# Altium schematic sheet wifi.SchDoc
size A
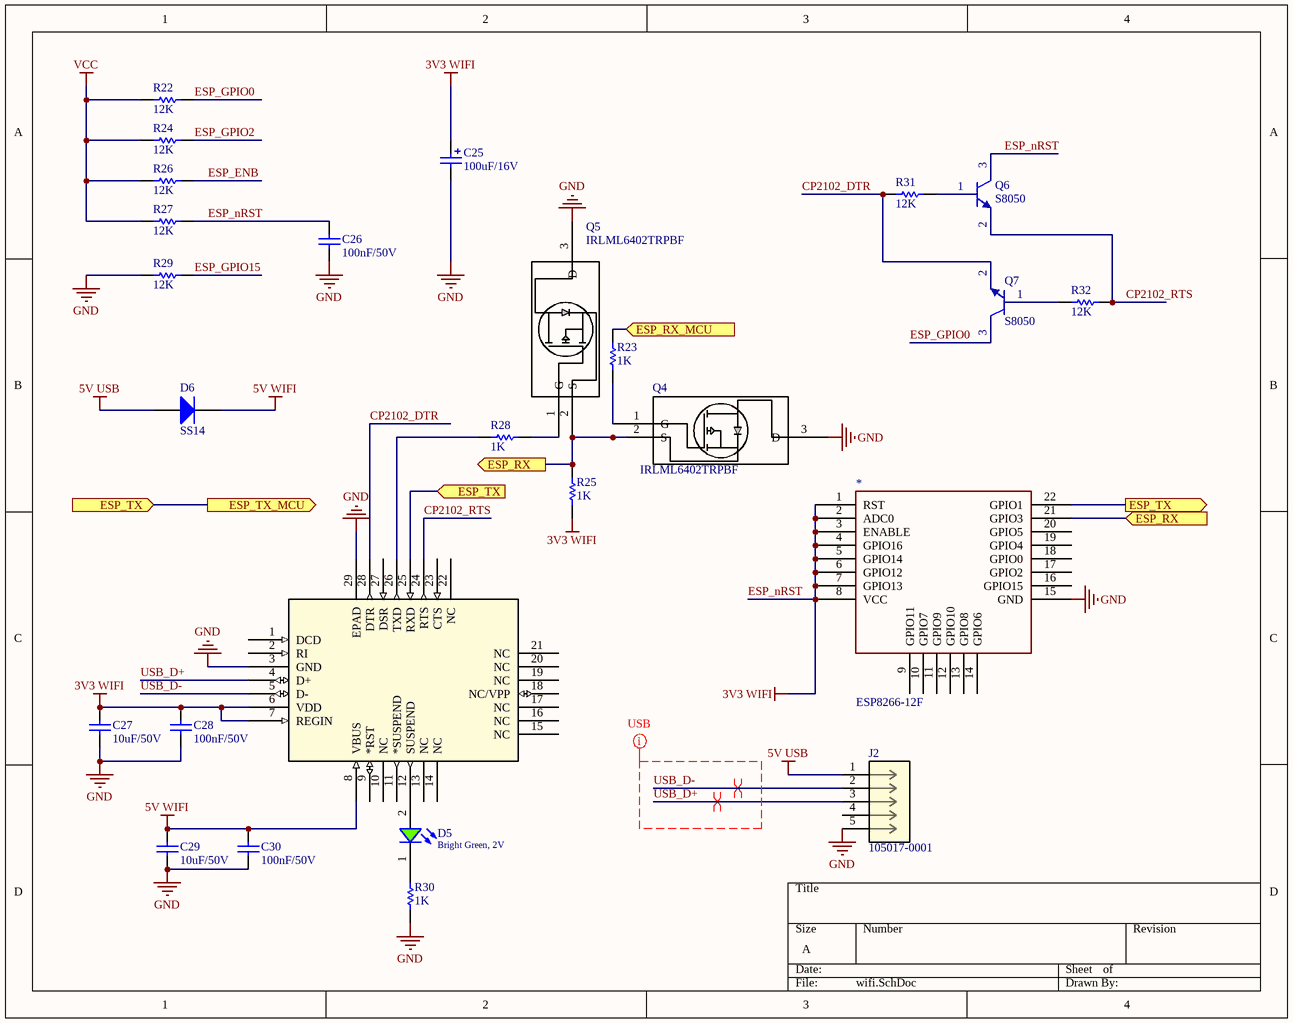
[diagram p0: wifi.SchDoc]

## Parts
*  ESP8266-12F  [ESP8266-12F]
?  (no value)  [QFN28_5X5_SIL]
C25  value 100uF/16V  [CAP_SM_TAN]  (hidden comment: TAJB107M006RNJ)
C26  value 100nF/50V  [CAP-SM-0805]  (hidden comment: Cap-100nF-50V-0805)
C27  value 10uF/50V  [CAP-SM-0805]  (hidden comment: Cap-10uF-50V-0805)
C28  value 100nF/50V  [CAP-SM-0805]  (hidden comment: Cap-100nF-50V-0805)
C29  value 10uF/50V  [CAP-SM-0805]  (hidden comment: Cap-10uF-50V-0805)
C30  value 100nF/50V  [CAP-SM-0805]  (hidden comment: Cap-100nF-50V-0805)
D5  Bright Green, 2V  [WL-SMCW_0805]
D6  SS14  [SS14]
J2  105017-0001  [CONN_105017-0001]
Q4  IRLML6402TRPBF  [SOT23_INF]
Q5  IRLML6402TRPBF  [SOT23_INF]
Q6  S8050  [SOT23_NEX]
Q7  S8050  [SOT23_NEX]
R22  value 12K  [RES-SM-0805]  (hidden comment: Res-12K-0805)
R23  value 1K  [RES-SM-0805]  (hidden comment: Res-1K-0805)
R24  value 12K  [RES-SM-0805]  (hidden comment: Res-12K-0805)
R25  value 1K  [RES-SM-0805]  (hidden comment: Res-1K-0805)
R26  value 12K  [RES-SM-0805]  (hidden comment: Res-12K-0805)
R27  value 12K  [RES-SM-0805]  (hidden comment: Res-12K-0805)
R28  value 1K  [RES-SM-0805]  (hidden comment: Res-1K-0805)
R29  value 12K  [RES-SM-0805]  (hidden comment: Res-12K-0805)
R30  value 1K  [RES-SM-0805]  (hidden comment: Res-1K-0805)
R31  value 12K  [RES-SM-0805]  (hidden comment: Res-12K-0805)
R32  value 12K  [RES-SM-0805]  (hidden comment: Res-12K-0805)

## Ports
ESP_RX (in), ESP_RX (out), ESP_RX_MCU (in), ESP_TX (in), ESP_TX (out), ESP_TX_MCU (out)

## Nets
5V USB: D6.2(A) J2.1
5V WIFI: ?.8(VBUS) C29.2 C30.2 D6.1(K)
ESP_nRST: *.1(RST) *.2(ADC0) *.3(ENABLE) *.4(GPIO16) *.5(GPIO14) *.6(GPIO12) *.7(GPIO13) *.8(VCC) ?.6(VDD) ?.7(REGIN) C25.1 C26.2 C27.2 C28.2 Q6.3(C) R25.1 R27.2  [also labelled 3V3 WIFI]
GND: *.15(GND) ?.3(GND) ?.29(EPAD) C25.2 C26.1 C27.1 C28.1 C29.1 C30.1 J2.5 Q4.3(D) Q5.3(D) R29.1 R30.1
VCC: R22.1 R24.1 R26.1 R27.1
CP2102_DTR: ?.28(DTR) Q7.2(E) R31.1
CP2102_RTS: ?.24(RTS) Q6.2(E) R32.2
ESP_ENB: R26.2
ESP_GPIO0: Q7.3(C) R22.2
ESP_GPIO2: R24.2
ESP_GPIO15: R29.2
ESP_RX: *.21(GPIO3) Q4.2(S) Q5.2(S) R25.2 ; port ESP_RX
ESP_RX_MCU: R23.1 ; port ESP_RX_MCU
ESP_TX: *.22(GPIO1) ?.25(RXD) ; port ESP_TX, port ESP_TX_MCU
USB_D+: ?.4(D+) J2.3
USB_D-: ?.5(D-) J2.2
Net?_12: ?.12(SUSPEND) D5.2(A)
Net?_26: ?.26(TXD) R28.1
NetD5_1: D5.1(K) R30.2
NetQ4_1: Q4.1(G) R23.2
NetQ5_1: Q5.1(G) R28.2
NetQ6_1: Q6.1(B) R31.2
NetQ7_1: Q7.1(B) R32.1

Not connected (* = marked no-connect by the designer): * 9(GPIO11) 10(GPIO7) 11(GPIO9) 12(GPIO10) 13(GPIO8) 14(GPIO6) 16(GPIO15) 17(GPIO2) 18(GPIO0) 19(GPIO4) 20(GPIO5); ? 1(DCD) 2(RI) 9(*RST) 10(NC) 11(*SUSPEND) 13(NC) 14(NC) 15(NC) 16(NC) 17(NC) 18(NC/VPP) 19(NC) 20(NC) 21(NC) 22(NC) 23(CTS) 27(DSR); J2 4

## Layout directives
differential pair: USB_D+, USB_D-
mark named USB: USB_D+, USB_D-

## Library data of the parts
? = CP2102-GM: No Description Available; Vendor: Silicon Labs; Built_By: EMA_UL_Team; SourceLibrary: Silicon_Labs_2015-03-23; Manufacturer_Part_Number: CP2102-GM; Copyright: Copyright (C) 2018 Accelerated Designs. All rights reserved; RefDes: RefDes; Type: DEV
C25 = Cap-Tan-100uF-16V: Manufacturer: Nichicon; Manufacturer Part Number: UWX1C101MCL1GB; Local Supplier: icdayroi; Local Supplier Link: https://icdayroi.com/tu-tantalum-100uf-16v-smd6032; Supplier 1: Digikey; Supplier 1 Part Number: 493-2105-1-ND; Supplier 1 Link: https://www.digikey.com/product-detail/en/nichicon/UWX1C101MCL1GB/493-2105-1-ND/590080
C26 C28 C30 = Cap-100nF-50V-0805: CAP CER 0.1UF 50V Y5V 0805; Manufacturer: Samsung Electro-Mechanics; Manufacturer Part Number: CL21F104ZBCNNNC; Local Supplier: thegioiic; Local Supplier Link: https://thegioiic.com/products/tu-100nf-0-1uf-50v-0805; Supplier 1: Digikey; Supplier 1 Part Number: 1276-1007-1-ND; Supplier 1 Link: https://www.digikey.com/product-detail/en/samsung-electro-mechanics/CL21F104ZBCNNNC/1276-1007-1-ND/3889093
C27 C29 = Cap-10uF-50V-0805: CAP CER 10UF 50V X5R 0805; Manufacturer: Yageo; Manufacturer Part Number: CC0805KKX5R9BB106; Local Supplier: thegioiic; Local Supplier Link: https://thegioiic.com/products/tu-10uf-50v-0805; Supplier 1: Digikey; Supplier 1 Link: https://www.digikey.com/product-detail/en/yageo/CC0805KKX5R9BB106/311-3499-2-ND/7164383; Supplier 1 Part Number: 311-3499-2-ND
D5 = 150080VS75000: WL-SMCW SMT Mono-color Chip LED Waterclear, size 0805, Bright Green, 2V, 140deg; Chip Technology: AlInGaP; Dominant Wavelength typ.: 570nm; Luminous Intensity typ.: 40mcd; Peak Wavelength typ.: 572nm; Viewing Angle: 140deg; ComponentLink1Description: Manufacturer; ComponentLink1URL: http://www.we-online.de; ComponentLink2URL: https://www.we-online.com/catalog/datasheet/150080VS75000.pdf; ComponentLink2Description: Datasheet; Forward Voltage typ.: 2V; Emitting Color: Bright Green; Mounting Technology: SMT; Operating Temperature: -40 to +85degC; Published Date: December 2019; Part Number: 150080VS75000; Packaging: Tape and Reel; Size: 0805; Publisher: Wurth Elektronik
D6 = Diode-SS14: DIODE SCHOTTKY 40V 1A SMA; Manufacturer: ON Semiconductor; Local Supplier: thegioiic; Local Supplier Link: https://thegioiic.com/products/ss14-sma; Supplier 1: Digikey; Supplier 1 Link: https://www.digikey.com/product-detail/en/on-semiconductor/SS14/SS14CT-ND/965729; Manufacturer Part Number: SS14; Supplier 1 Part Number: SS14CT-ND
J2 = 105017-0001: No Description Available; Vendor: Molex Connector Corporation; Built_By: EMA_Cory; SourceLibrary: Molex_2020-05-26; Datasheet: https://www.molex.com/pdm_docs/sd/1050170001_sd.pdf; Manufacturer_Part_Number: 105017-0001; Copyright: Copyright (C) 2018 Accelerated Designs. All rights reserved; RefDes: RefDes; Type: DEV
Q4 Q5 = IRLML6402TRPBF: No Description Available; Source_Library: Infineon_2020-02-27.xlr; Built_By: EMA_Justin; SourceLibrary: Infineon_2020-02-27; Vendor: Infineon; Type: DEV; Copyright: Copyright (C) 2018 Accelerated Designs. All rights reserved; Manufacturer_Part_Number: IRLML6402TRPBF; RefDes: RefDes
R22 R24 R26 R27 R29 R31 R32 = Res-12K-0805: RES 12 KOHM JUMPER 0805; Manufacturer: Vishay Thin Film; Manufacturer Part Number: PAT0805E3121BST1; Local Supplier: icdayroi; Local Supplier Link: https://icdayroi.com/dien-tro-12k-0805-1-goi-50-con; Supplier 1: Digikey; Supplier 1 Link: https://www.digikey.com/product-detail/en/vishay-thin-film/PAT0805E3121BST1/PAT0805E3121BST1-ND/2281536; Supplier 1 Part Number: PAT0805E3121BST1-ND
R23 R25 R28 R30 = Res-1K-0805: RES 1K OHM 1% 1/4W 0805; Manufacturer: Stackpole Electronics Inc; Manufacturer Part Number: RNCP0805FTD1K00; Local Supplier: thegioiic; Local Supplier Link: https://thegioiic.com/products/dien-tro-1k-ohm-0805-5; Supplier 1: Digikey; Supplier 1 Link: https://www.digikey.com/product-detail/en/stackpole-electronics-inc/RNCP0805FTD1K00/RNCP0805FTD1K00CT-ND/2240568; Supplier 1 Part Number: RNCP0805FTD1K00CT-ND
* = ESP8266-12F: Local Supplier: HShop; Local Supplier Link: https://hshop.vn/products/mach-thu-phat-wifi-soc-esp8266-v12; Local Supplier Part Number: HS000912; Manufacturer: *; Manufacturer Part Number: *